# Altium schematic sheet PG05_DSP_Circuit.SchDoc
size A3
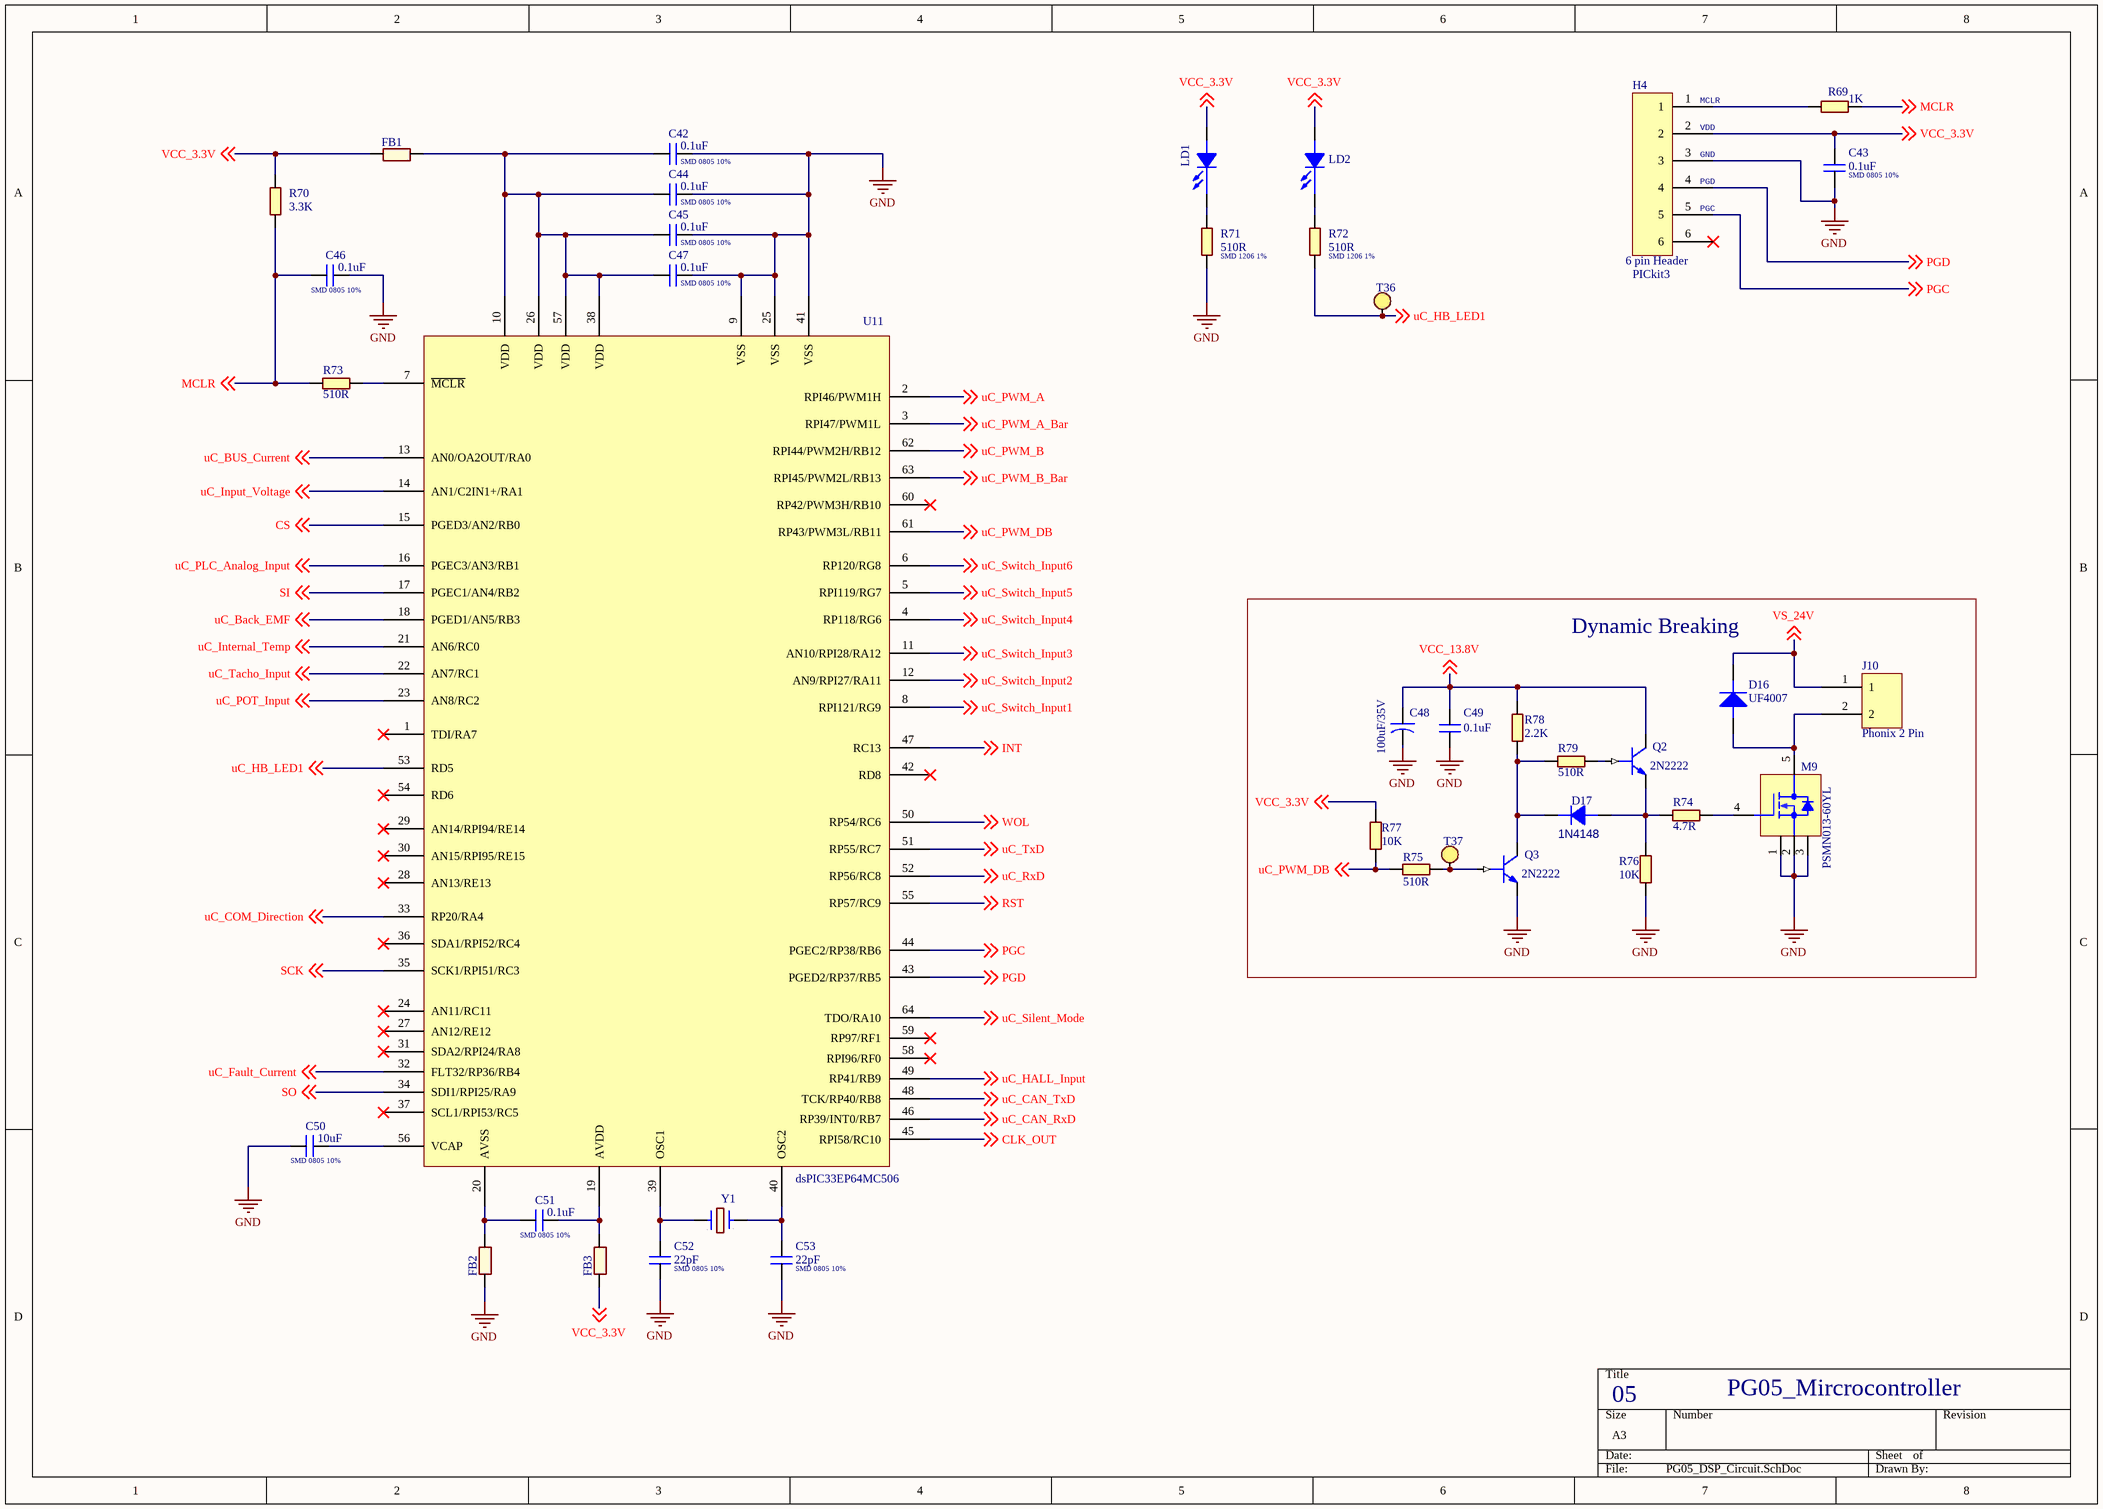
[diagram p0: PG05_DSP_Circuit.SchDoc]

## Parts
C42  SMD 0805 10%  value 0.1uF  [SMD0805]
C43  SMD 0805 10%  value 0.1uF  [SMD0805]
C44  SMD 0805 10%  value 0.1uF  [SMD0805]
C45  SMD 0805 10%  value 0.1uF  [SMD0805]
C46  SMD 0805 10%  value 0.1uF  [SMD0805]
C47  SMD 0805 10%  value 0.1uF  [SMD0805]
C48  value 100uF/35V  [CAP_8mm]  (hidden comment: Cap 5mm radial)
C49  value 0.1uF  [SMD0805]  (hidden comment: SMD 0805 10%)
C50  SMD 0805 10%  value 10uF  [SMD0805]
C51  SMD 0805 10%  value 0.1uF  [SMD0805]
C52  SMD 0805 10%  value 22pF  [SMD0805]
C53  SMD 0805 10%  value 22pF  [SMD0805]
D16  value UF4007  [DO-214(SMA)]  (hidden comment: Diode SMA)
D17  1N4148  [SOD-80]
FB1  Ferrite Bead  [SMD0805]  (value not drawn)
FB2  Ferrite Bead  [SMD0805]  (value not drawn)
FB3  Ferrite Bead  [SMD0805]  (value not drawn)
H4  PICkit3  value 6 pin Header  [Header1x6]
J10  Phonix 2 Pin  [PHONIX2]
LD1  LED  [LED]  (value not drawn)
LD2  LED  [LED]  (value not drawn)
M9  value PSMN013-60YL  [SO8-L]  (hidden comment: N MOSFET)
Q2  value 2N2222  [SOT23-3-Leads]  (hidden comment: SMD NPN BJT)
Q3  value 2N2222  [SOT23-3-Leads]  (hidden comment: SMD NPN BJT)
R69  value 1K  [SMD1206]  (hidden comment: SMD 1206 1%)
R70  value 3.3K  [SMD1206]  (hidden comment: SMD 1206 1%)
R71  SMD 1206 1%  value 510R  [SMD1206]
R72  SMD 1206 1%  value 510R  [SMD1206]
R73  value 510R  [SMD1206]  (hidden comment: SMD 1206 1%)
R74  value 4.7R  [SMD1206]  (hidden comment: SMD 1206 1%)
R75  value 510R  [SMD1206]  (hidden comment: SMD 1206 1%)
R76  value 10K  [SMD1206]  (hidden comment: SMD 1206 1%)
R77  value 10K  [SMD1206]  (hidden comment: SMD 1206 1%)
R78  value 2.2K  [SMD1206]  (hidden comment: SMD 1206 1%)
R79  value 510R  [SMD1206]  (hidden comment: SMD 1206 1%)
T36  Through hole TestPoint  [TP]  (value not drawn)
T37  Through hole TestPoint  [TP]  (value not drawn)
U11  value dsPIC33EP64MC506  [Quad64]  (hidden comment: DSP)
Y1  7.3728MHz  [XTAL]  (value not drawn)

## Blocks framed on the sheet
Dynamic Breaking: C48 C49 D16 D17 J10 M9 Q2 Q3 R74-R79 T37

## Nets
GND: C42.2 C43.1 C44.2 C45.2 C46.2 C47.2 C48.2 C49.2 C50.1 C52.1 C53.1 FB2.2 H4.3 M9.1 M9.2 M9.3 Q3.2(EMITTER) R71.2 R76.2 U11.9(VSS) U11.25(VSS) U11.41(VSS)
CLK_OUT: U11.45(RPI58/RC10) ; off-sheet CLK_OUT
CS: U11.15(PGED3/AN2/RB0) ; off-sheet CS
INT: U11.47(RC13) ; off-sheet INT
MCLR: C46.1 R69.1 R70.1 R73.2 ; off-sheet MCLR
PGC: H4.5 U11.44(PGEC2/RP38/RB6) ; off-sheet PGC
PGD: H4.4 U11.43(PGED2/RP37/RB5) ; off-sheet PGD
RST: U11.55(RP57/RC9) ; off-sheet RST
SCK: U11.35(SCK1/RPI51/RC3) ; off-sheet SCK
SI: U11.17(PGEC1/AN4/RB2) ; off-sheet SI
SO: U11.34(SDI1/RPI25/RA9) ; off-sheet SO
uC_Back_EMF: U11.18(PGED1/AN5/RB3) ; off-sheet uC_Back_EMF
uC_BUS_Current: U11.13(AN0/OA2OUT/RA0) ; off-sheet uC_BUS_Current
uC_CAN_RxD: U11.46(RP39/INT0/RB7) ; off-sheet uC_CAN_RxD
uC_CAN_TxD: U11.48(TCK/RP40/RB8) ; off-sheet uC_CAN_TxD
uC_COM_Direction: U11.33(RP20/RA4) ; off-sheet uC_COM_Direction
uC_Fault_Current: U11.32(FLT32/RP36/RB4) ; off-sheet uC_Fault_Current
uC_HALL_Input: U11.49(RP41/RB9) ; off-sheet uC_HALL_Input
uC_HB_LED1: R72.2 T36.1 U11.53(RD5) ; off-sheet uC_HB_LED1
uC_Input_Voltage: U11.14(AN1/C2IN1+/RA1) ; off-sheet uC_Input_Voltage
uC_Internal_Temp: U11.21(AN6/RC0) ; off-sheet uC_Internal_Temp
uC_PLC_Analog_Input: U11.16(PGEC3/AN3/RB1) ; off-sheet uC_PLC_Analog_Input
uC_POT_Input: U11.23(AN8/RC2) ; off-sheet uC_POT_Input
uC_PWM_A: U11.2(RPI46/PWM1H) ; off-sheet uC_PWM_A
uC_PWM_A_Bar: U11.3(RPI47/PWM1L) ; off-sheet uC_PWM_A_Bar
uC_PWM_B: U11.62(RPI44/PWM2H/RB12) ; off-sheet uC_PWM_B
uC_PWM_B_Bar: U11.63(RPI45/PWM2L/RB13) ; off-sheet uC_PWM_B_Bar
uC_PWM_DB: R75.1 R77.1 U11.61(RP43/PWM3L/RB11) ; off-sheet uC_PWM_DB
uC_RxD: U11.52(RP56/RC8) ; off-sheet uC_RxD
uC_Silent_Mode: U11.64(TDO/RA10) ; off-sheet uC_Silent_Mode
uC_Switch_Input1: U11.8(RPI121/RG9) ; off-sheet uC_Switch_Input1
uC_Switch_Input2: U11.12(AN9/RPI27/RA11) ; off-sheet uC_Switch_Input2
uC_Switch_Input3: U11.11(AN10/RPI28/RA12) ; off-sheet uC_Switch_Input3
uC_Switch_Input4: U11.4(RP118/RG6) ; off-sheet uC_Switch_Input4
uC_Switch_Input5: U11.5(RPI119/RG7) ; off-sheet uC_Switch_Input5
uC_Switch_Input6: U11.6(RP120/RG8) ; off-sheet uC_Switch_Input6
uC_Tacho_Input: U11.22(AN7/RC1) ; off-sheet uC_Tacho_Input
uC_TxD: U11.51(RP55/RC7) ; off-sheet uC_TxD
VCC_3.3V: C43.2 FB1.2 FB3.2 H4.2 LD1.1(ANODE) LD2.1(ANODE) R70.2 R77.2 ; off-sheet VCC_3.3V
VCC_13.8V: C48.1 C49.1 Q2.3(COLLECTOR) R78.1 ; off-sheet VCC_13.8V
VS_24V: D16.2 J10.1 ; off-sheet VS_24V
WOL: U11.50(RP54/RC6) ; off-sheet WOL
NetC42_1: C42.1 C44.1 C45.1 C47.1 FB1.1 U11.10(VDD) U11.26(VDD) U11.38(VDD) U11.57(VDD)
NetC50_2: C50.2 U11.56(VCAP)
NetC51_1: C51.1 FB2.1 U11.20(AVSS)
NetC51_2: C51.2 FB3.1 U11.19(AVDD)
NetC52_2: C52.2 U11.39(OSC1) Y1.1
NetC53_2: C53.2 U11.40(OSC2) Y1.2
NetD16_1: D16.1 J10.2 M9.5
NetD17_1: D17.1(ANODE) Q2.2(EMITTER) R74.2 R76.1
NetD17_2: D17.2(CATHODE) Q3.3(COLLECTOR) R78.2 R79.1
NetH4_1: H4.1 R69.2
NetLD1_2: LD1.2(CATHODE) R71.1
NetLD2_2: LD2.2(CATHODE) R72.1
NetM9_4: M9.4(G) R74.1
NetQ2_1: Q2.1(BASE) R79.2
NetQ3_1: Q3.1(BASE) R75.2 T37.1
NetR73_1: R73.1 U11.7(~{MCLR})

Not connected (* = marked no-connect by the designer): H4 6*; U11 1(TDI/RA7)* 24(AN11/RC11)* 27(AN12/RE12)* 28(AN13/RE13)* 29(AN14/RPI94/RE14)* 30(AN15/RPI95/RE15)* 31(SDA2/RPI24/RA8)* 36(SDA1/RPI52/RC4)* 37(SCL1/RPI53/RC5)* 42(RD8)* 54(RD6)* 58(RPI96/RF0)* 59(RP97/RF1)* 60(RP42/PWM3H/RB10)*

## Notes on the sheet
- (near H4) MCLR
- (near H4) GND
- (near H4) PGD
- (near H4) VDD
- (near H4) PGC
- PG05_Mircrocontroller
- 05

## Library data of the parts
C42-C47 C49-C53 = CAP_SMD: Manufacturer: Vishay
C48 = CAP_Electolytic_5mm: Manufacturer: Nichicon
D16 = Diode_SMA: Manufacturer: Diodes Corp
D17 = 1N4148: Part No.: SM4007; Manufacturer: Vishay; Source Of Supply: Rajiv Electronics,Pune; Type: Component; Temp. Range: -65 to 150 Deg. Cel.; Tolerance: 10%; Rating: -; Temp. Coeff.: -; Termination: -; Marking: -; Category: Diode
FB1-FB3 = R_3: Manufacturer: Vishay Semiconductors; Source Of Supply: Rajiv Electronics,Pune; Type: Component; Value: Bead Ferrite
H4 = Header_6_Pin
J10 = Phonix_2_Pin
LD1 LD2 = LED: Manufacturer: Rajeev; Value: Red LED Through hole
M9 = MOS_PSMN013-60YL: Manufacturer: NxP
Q2 Q3 = 2N3904_1: Manufacturer: OnSemi
R69-R79 = RES_SMD: Manufacturer: Vishay; Description: SMD1206  1% Resistor
T36 T37 = TestPoint_TH: Value: TP
U11 = dsPIC33EP64MC506: Manufacturer: Microchip
Y1 = Crystal